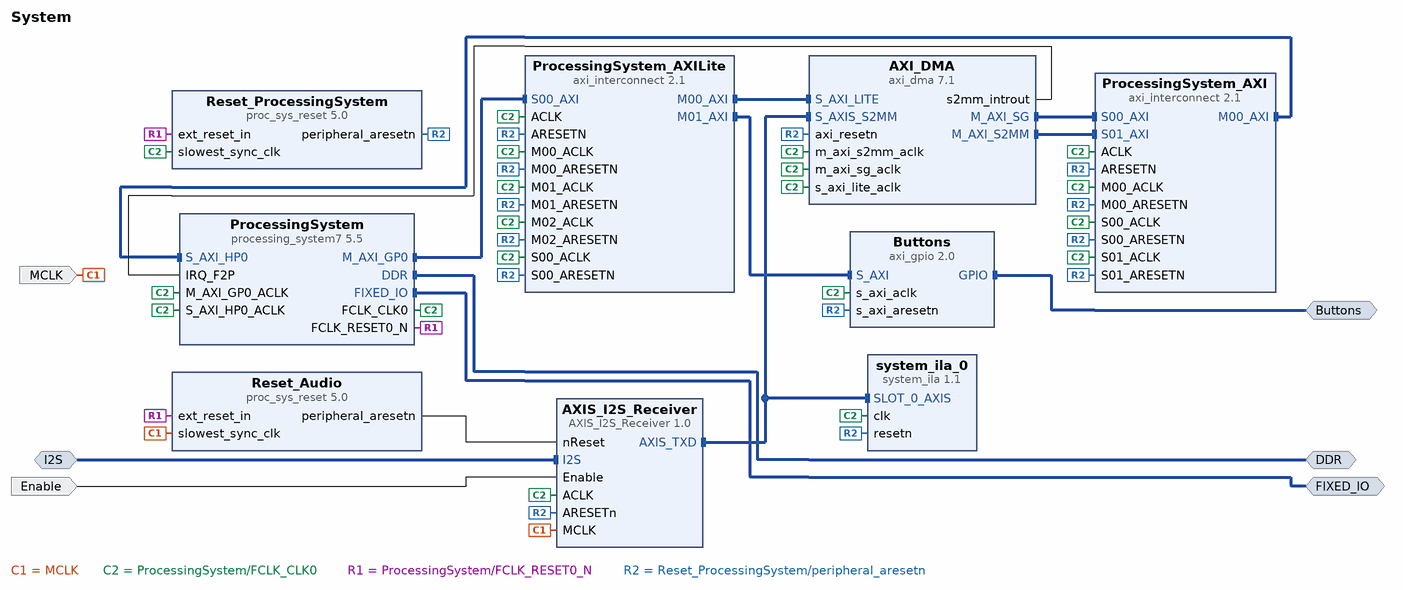
[diagram p0: block diagram of the top level]
# Vivado block design System, xc7z010clg400-1, Vivado 2020.2
create_bd_design System

create_bd_intf_port -mode Master -vlnv xilinx.com:interface:ddrx_rtl:1.0 DDR
create_bd_intf_port -mode Master -vlnv xilinx.com:display_processing_system7:fixedio_rtl:1.0 FIXED_IO
create_bd_intf_port -mode Slave -vlnv www.kampis-elektroecke.de:Kampis-Elektroecke:I2S_rtl:1.0 I2S
create_bd_intf_port -mode Master -vlnv xilinx.com:interface:gpio_rtl:1.0 Buttons
create_bd_port -dir I -type clk MCLK
set_property -dict {CONFIG.FREQ_HZ 12288013 CONFIG.PHASE 0.0} [get_bd_ports MCLK]
create_bd_port -dir I Enable

create_bd_cell -type ip -vlnv xilinx.com:ip:processing_system7:5.5 ProcessingSystem
set_property -dict [list \
  CONFIG.PCW_APU_PERIPHERAL_FREQMHZ 650.000000 \
  CONFIG.PCW_CRYSTAL_PERIPHERAL_FREQMHZ 50.000000 \
  CONFIG.PCW_ENET0_PERIPHERAL_ENABLE 0 \
  CONFIG.PCW_FCLK1_PERIPHERAL_CLKSRC {DDR PLL} \
  CONFIG.PCW_FCLK2_PERIPHERAL_CLKSRC {ARM PLL} \
  CONFIG.PCW_FPGA0_PERIPHERAL_FREQMHZ 100.000000 \
  CONFIG.PCW_FPGA1_PERIPHERAL_FREQMHZ 175.000000 \
  CONFIG.PCW_FPGA2_PERIPHERAL_FREQMHZ 12.288000 \
  CONFIG.PCW_FPGA3_PERIPHERAL_FREQMHZ 100.000000 \
  CONFIG.PCW_GPIO_MIO_GPIO_ENABLE 0 \
  CONFIG.PCW_GPIO_PERIPHERAL_ENABLE 1 \
  CONFIG.PCW_IMPORT_BOARD_PRESET C:/Users/Daniel.Kampert/Desktop/Git/ZYBO/res/Zybo.xml \
  CONFIG.PCW_IRQ_F2P_INTR 1 \
  CONFIG.PCW_PRESET_BANK1_VOLTAGE {LVCMOS 1.8V} \
  CONFIG.PCW_QSPI_GRP_SINGLE_SS_ENABLE 1 \
  CONFIG.PCW_QSPI_GRP_SINGLE_SS_IO {MIO 1 .. 6} \
  CONFIG.PCW_QSPI_PERIPHERAL_ENABLE 1 \
  CONFIG.PCW_QSPI_QSPI_IO {MIO 1 .. 6} \
  CONFIG.PCW_SD0_GRP_CD_ENABLE 1 \
  CONFIG.PCW_SD0_GRP_CD_IO {MIO 47} \
  CONFIG.PCW_SD0_GRP_WP_ENABLE 1 \
  CONFIG.PCW_SD0_GRP_WP_IO EMIO \
  CONFIG.PCW_SD0_PERIPHERAL_ENABLE 1 \
  CONFIG.PCW_SD0_SD0_IO {MIO 40 .. 45} \
  CONFIG.PCW_SDIO_PERIPHERAL_FREQMHZ 50 \
  CONFIG.PCW_SINGLE_QSPI_DATA_MODE x4 \
  CONFIG.PCW_UART1_PERIPHERAL_ENABLE 1 \
  CONFIG.PCW_UART1_UART1_IO {MIO 48 .. 49} \
  CONFIG.PCW_UART_PERIPHERAL_FREQMHZ 50 \
  CONFIG.PCW_UIPARAM_DDR_FREQ_MHZ 525.000000 \
  CONFIG.PCW_UIPARAM_DDR_PARTNO {MT41K128M16 JT-125} \
  CONFIG.PCW_USB0_PERIPHERAL_ENABLE 0 \
  CONFIG.PCW_USE_FABRIC_INTERRUPT 1 \
  CONFIG.PCW_USE_S_AXI_HP0 1 \
] [get_bd_cells ProcessingSystem]
# 309 more settings of ProcessingSystem are not shown: defaults, MIO pin electricals, DDR timing, and values the tool derives
create_bd_cell -type ip -vlnv xilinx.com:ip:proc_sys_reset:5.0 Reset_ProcessingSystem
create_bd_cell -type ip -vlnv xilinx.com:ip:proc_sys_reset:5.0 Reset_Audio
create_bd_cell -type ip -vlnv xilinx.com:ip:axi_interconnect:2.1 ProcessingSystem_AXILite
set_property -dict {CONFIG.NUM_MI 3} [get_bd_cells ProcessingSystem_AXILite]
create_bd_cell -type ip -vlnv xilinx.com:ip:axi_dma:7.1 AXI_DMA
set_property -dict {CONFIG.c_include_mm2s 0 CONFIG.c_include_sg 1 CONFIG.c_sg_include_stscntrl_strm 0} [get_bd_cells AXI_DMA]
create_bd_cell -type ip -vlnv xilinx.com:ip:axi_gpio:2.0 Buttons
set_property -dict {CONFIG.C_ALL_INPUTS 1 CONFIG.C_GPIO_WIDTH 4} [get_bd_cells Buttons]
create_bd_cell -type ip -vlnv xilinx.com:ip:axi_interconnect:2.1 ProcessingSystem_AXI
set_property -dict {CONFIG.NUM_MI 1 CONFIG.NUM_SI 2} [get_bd_cells ProcessingSystem_AXI]
create_bd_cell -type ip -vlnv xilinx.com:ip:system_ila:1.1 system_ila_0
set_property -dict [list \
  CONFIG.ALL_PROBE_SAME_MU_CNT 2 \
  CONFIG.C_DATA_DEPTH 16384 \
  CONFIG.C_EN_STRG_QUAL 1 \
  CONFIG.C_MON_TYPE INTERFACE \
  CONFIG.C_NUM_MONITOR_SLOTS 1 \
  CONFIG.C_PROBE0_MU_CNT 2 \
  CONFIG.C_SLOT_0_APC_EN 0 \
  CONFIG.C_SLOT_0_AXI_DATA_SEL 1 \
  CONFIG.C_SLOT_0_AXI_TRIG_SEL 1 \
  CONFIG.C_SLOT_0_INTF_TYPE xilinx.com:interface:axis_rtl:1.0 \
] [get_bd_cells system_ila_0]
create_bd_cell -type ip -vlnv www.kampis-elektroecke.de:Kampis-Elektroecke:AXIS_I2S_Receiver:1.0 AXIS_I2S_Receiver
set_property -dict {CONFIG.LENGTH 128} [get_bd_cells AXIS_I2S_Receiver]

# ---- connections ----

connect_bd_intf_net [get_bd_intf_pins ProcessingSystem/M_AXI_GP0] [get_bd_intf_pins ProcessingSystem_AXILite/S00_AXI]
connect_bd_intf_net [get_bd_intf_pins ProcessingSystem_AXILite/M00_AXI] [get_bd_intf_pins AXI_DMA/S_AXI_LITE]
connect_bd_intf_net -intf_net AXIS_I2S_Receiver_AXIS_TXD [get_bd_intf_pins AXIS_I2S_Receiver/AXIS_TXD] [get_bd_intf_pins AXI_DMA/S_AXIS_S2MM]
connect_bd_intf_net [get_bd_intf_pins AXIS_I2S_Receiver/AXIS_TXD] [get_bd_intf_pins system_ila_0/SLOT_0_AXIS]
connect_bd_intf_net [get_bd_intf_ports DDR] [get_bd_intf_pins ProcessingSystem/DDR]
connect_bd_intf_net [get_bd_intf_ports Buttons] [get_bd_intf_pins Buttons/GPIO]
connect_bd_intf_net [get_bd_intf_pins AXI_DMA/M_AXI_SG] [get_bd_intf_pins ProcessingSystem_AXI/S00_AXI]
connect_bd_intf_net -intf_net I2S_0_1 [get_bd_intf_ports I2S] [get_bd_intf_pins AXIS_I2S_Receiver/I2S]
connect_bd_intf_net [get_bd_intf_pins AXI_DMA/M_AXI_S2MM] [get_bd_intf_pins ProcessingSystem_AXI/S01_AXI]
connect_bd_intf_net [get_bd_intf_pins ProcessingSystem_AXILite/M01_AXI] [get_bd_intf_pins Buttons/S_AXI]
connect_bd_intf_net [get_bd_intf_pins ProcessingSystem_AXI/M00_AXI] [get_bd_intf_pins ProcessingSystem/S_AXI_HP0]
connect_bd_intf_net [get_bd_intf_ports FIXED_IO] [get_bd_intf_pins ProcessingSystem/FIXED_IO]
connect_bd_net [get_bd_pins AXI_DMA/s2mm_introut] [get_bd_pins ProcessingSystem/IRQ_F2P]
connect_bd_net -net Enable_0_1 [get_bd_ports Enable] [get_bd_pins AXIS_I2S_Receiver/Enable]
connect_bd_net -net MCLK_0_1 [get_bd_ports MCLK] [get_bd_pins Reset_Audio/slowest_sync_clk] [get_bd_pins AXIS_I2S_Receiver/MCLK]
connect_bd_net [get_bd_pins ProcessingSystem/FCLK_CLK0] \
  [get_bd_pins Reset_ProcessingSystem/slowest_sync_clk] [get_bd_pins ProcessingSystem/M_AXI_GP0_ACLK] \
  [get_bd_pins ProcessingSystem/S_AXI_HP0_ACLK] [get_bd_pins ProcessingSystem_AXILite/ACLK] \
  [get_bd_pins ProcessingSystem_AXILite/S00_ACLK] [get_bd_pins ProcessingSystem_AXILite/M00_ACLK] \
  [get_bd_pins ProcessingSystem_AXILite/M01_ACLK] [get_bd_pins ProcessingSystem_AXILite/M02_ACLK] \
  [get_bd_pins AXI_DMA/s_axi_lite_aclk] [get_bd_pins AXI_DMA/m_axi_sg_aclk] [get_bd_pins AXI_DMA/m_axi_s2mm_aclk] \
  [get_bd_pins Buttons/s_axi_aclk] [get_bd_pins ProcessingSystem_AXI/ACLK] [get_bd_pins ProcessingSystem_AXI/S00_ACLK] \
  [get_bd_pins ProcessingSystem_AXI/S01_ACLK] [get_bd_pins ProcessingSystem_AXI/M00_ACLK] [get_bd_pins system_ila_0/clk] \
  [get_bd_pins AXIS_I2S_Receiver/ACLK]
connect_bd_net [get_bd_pins ProcessingSystem/FCLK_RESET0_N] [get_bd_pins Reset_ProcessingSystem/ext_reset_in] [get_bd_pins Reset_Audio/ext_reset_in]
connect_bd_net [get_bd_pins Reset_Audio/peripheral_aresetn] [get_bd_pins AXIS_I2S_Receiver/nReset]
connect_bd_net [get_bd_pins Reset_ProcessingSystem/peripheral_aresetn] \
  [get_bd_pins ProcessingSystem_AXILite/ARESETN] [get_bd_pins ProcessingSystem_AXILite/S00_ARESETN] \
  [get_bd_pins ProcessingSystem_AXILite/M00_ARESETN] [get_bd_pins ProcessingSystem_AXILite/M01_ARESETN] \
  [get_bd_pins ProcessingSystem_AXILite/M02_ARESETN] [get_bd_pins AXI_DMA/axi_resetn] [get_bd_pins Buttons/s_axi_aresetn] \
  [get_bd_pins ProcessingSystem_AXI/ARESETN] [get_bd_pins ProcessingSystem_AXI/S00_ARESETN] \
  [get_bd_pins ProcessingSystem_AXI/S01_ARESETN] [get_bd_pins ProcessingSystem_AXI/M00_ARESETN] \
  [get_bd_pins system_ila_0/resetn] [get_bd_pins AXIS_I2S_Receiver/ARESETn]
set_property HDL_ATTRIBUTE.BMM_INFO_PROCESSOR {arm > System BRAM_CPU} [get_bd_cells ProcessingSystem]
set_property HDL_ATTRIBUTE.KEEP_HIERARCHY yes [get_bd_cells ProcessingSystem]
set_property HDL_ATTRIBUTE.DEBUG true [get_bd_intf_nets AXIS_I2S_Receiver_AXIS_TXD]
set_property HDL_ATTRIBUTE.MARK_DEBUG true [get_bd_intf_nets AXIS_I2S_Receiver_AXIS_TXD]

# ---- address map ----
assign_bd_address -offset 0x00000000 -range 512M -target_address_space [get_bd_addr_spaces AXI_DMA/Data_S2MM] [get_bd_addr_segs ProcessingSystem/S_AXI_HP0/HP0_DDR_LOWOCM]
assign_bd_address -offset 0x00000000 -range 512M -target_address_space [get_bd_addr_spaces AXI_DMA/Data_SG] [get_bd_addr_segs ProcessingSystem/S_AXI_HP0/HP0_DDR_LOWOCM]
assign_bd_address -offset 0x40400000 -range 64K -target_address_space [get_bd_addr_spaces ProcessingSystem/Data] [get_bd_addr_segs AXI_DMA/S_AXI_LITE/Reg]
assign_bd_address -offset 0x41200000 -range 64K -target_address_space [get_bd_addr_spaces ProcessingSystem/Data] [get_bd_addr_segs Buttons/S_AXI/Reg]

validate_bd_design
save_bd_design
